# Altium schematic sheet MCU.SchDoc
size 259 x 167 mm; SheetNumber: 2; SheetTotal: 7
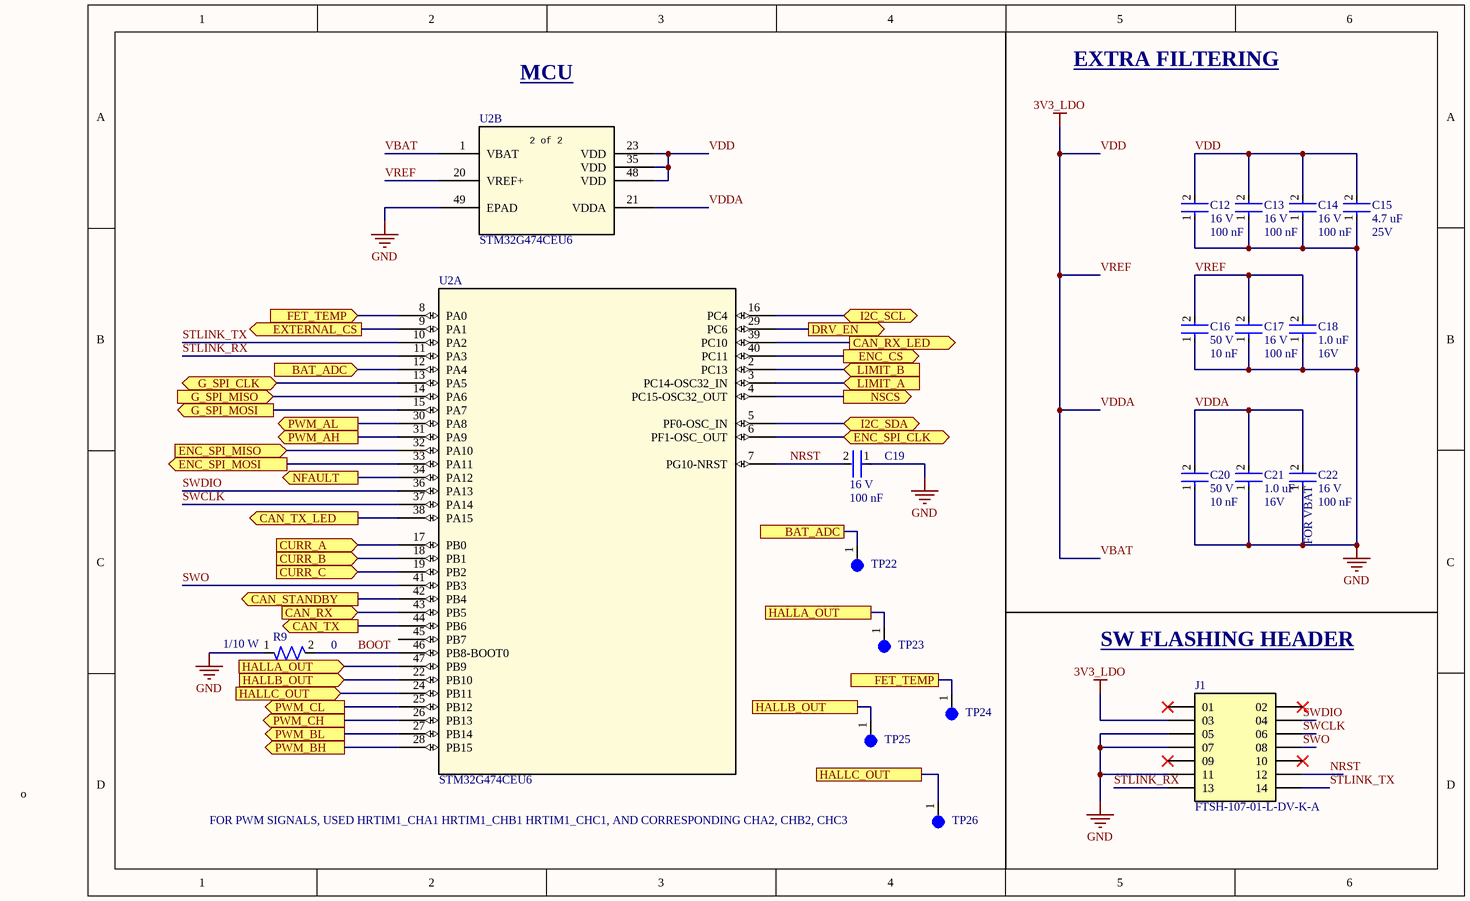
[diagram p0: MCU.SchDoc]

## Parts
C12  Voltage Rating: 16 V  Capacitance: 100 nF  [CAP-0402]  (hidden comment: CC0402KRX7R7BB104)
C13  Voltage Rating: 16 V  Capacitance: 100 nF  [CAP-0402]  (hidden comment: CC0402KRX7R7BB104)
C14  Voltage Rating: 16 V  Capacitance: 100 nF  [CAP-0402]  (hidden comment: CC0402KRX7R7BB104)
C15  Capacitance: 4.7 uF  Voltage: 25V  [CAP-0603]  (hidden comment: CC0603KRX5R8BB475)
C16  Voltage: 50 V  Capacitance: 10 nF  [CAP-0603]  (hidden comment: CC0603KPX7R9BB103)
C17  Voltage Rating: 16 V  Capacitance: 100 nF  [CAP-0402]  (hidden comment: CC0402KRX7R7BB104)
C18  Capacitance: 1.0 uF  Voltage: 16V  [CAP-0603]  (hidden comment: CC0603KRX7R7BB105)
C19  Voltage Rating: 16 V  Capacitance: 100 nF  [CAP-0402]  (hidden comment: CC0402KRX7R7BB104)
C20  Voltage: 50 V  Capacitance: 10 nF  [CAP-0603]  (hidden comment: CC0603KPX7R9BB103)
C21  Capacitance: 1.0 uF  Voltage: 16V  [CAP-0603]  (hidden comment: CC0603KRX7R7BB105)
C22  Voltage Rating: 16 V  Capacitance: 100 nF  [CAP-0402]  (hidden comment: CC0402KRX7R7BB104)
J1  FTSH-107-01-L-DV-K-A  [SAMTEC_FTSH-107-01-L-DV-K]
R9  Resistance: 0  Power: 1/10 W  [RES-0603]  (hidden comment: RMCF0603ZT0R00)
TP22  5003  [TEST-POINT-0001]  (value not drawn)
TP23  5003  [TEST-POINT-0001]  (value not drawn)
TP24  5003  [TEST-POINT-0001]  (value not drawn)
TP25  5003  [TEST-POINT-0001]  (value not drawn)
TP26  5003  [TEST-POINT-0001]  (value not drawn)
U2  STM32G474CEU6  [IC-QFPN48]  (parts A,B of 2)

## Ports
BAT_ADC (in, see Connectors[5A], MCU[3C]), BAT_ADC (see Connectors[5A], MCU[1B]), CAN_RX (in, see CAN[1B]), CAN_RX_LED (out, see CAN[6A]), CAN_STANDBY (out, see CAN[1B]), CAN_TX (out, see CAN[1B]), CAN_TX_LED (out, see CAN[4A]), CURR_A (in, see Driver[4C]), CURR_B (in, see Driver[4C]), CURR_C (in, see Driver[4C]), DRV_EN (out, see Driver[2B]), ENC_CS (out, see Encoder[2B]), ENC_SPI_CLK (bidir, see Connectors[1D], Encoder[2C]), ENC_SPI_MISO (in, see Connectors[2D], Encoder[2C]), ENC_SPI_MOSI (out, see Connectors[2D], Encoder[2C]), EXTERNAL_CS (out, see Connectors[1D]), FET_TEMP (in, see FETs[5B], MCU[4D]), FET_TEMP (see FETs[5B], MCU[1B]), G_SPI_CLK (bidir, see Driver[2C]), G_SPI_MISO (in, see Driver[1C]), G_SPI_MOSI (out, see Driver[2C]), HALLA_OUT (in, see Connectors[5C], MCU[3C]), HALLA_OUT (see Connectors[5C], MCU[1C]), HALLB_OUT (in, see Connectors[5C], MCU[3D]), HALLB_OUT (see Connectors[5C], MCU[1D]), HALLC_OUT (in, see Connectors[5D], MCU[4D]), HALLC_OUT (see Connectors[5D], MCU[1D]), I2C_SCL (bidir, see Connectors[2C]), I2C_SDA (bidir, see Connectors[1C]), LIMIT_A (in, see Connectors[2C]), LIMIT_B (in, see Connectors[3C]), NFAULT (out, see Driver[1D]), NSCS (out, see Driver[2C]), PWM_AH (out, see Driver[2C]), PWM_AL (out, see Driver[2C]), PWM_BH (out, see Driver[2C]), PWM_BL (out, see Driver[2C]), PWM_CH (out, see Driver[2C]), PWM_CL (out, see Driver[2C])

## Nets
GND: C12.1 C13.1 C14.1 C15.1 C16.1 C17.1 C18.1 C19.1 C20.1 C21.1 C22.1 J1.05 J1.07 J1.11 R9.1 U2.49(EPAD)
VBAT: C12.2 C13.2 C14.2 C15.2 C16.2 C17.2 C18.2 C20.2 C21.2 C22.2 J1.03 U2.1(VBAT) U2.20(VREF+) U2.21(VDDA) U2.23(VDD) U2.35(VDD) U2.48(VDD)  [also labelled 3V3_LDO, VDD, VDDA, VREF]
BAT_ADC: TP22.1 U2.12(PA4) ; port BAT_ADC
BOOT: R9.2 U2.46(PB8-BOOT0)
CAN_RX: U2.43(PB5) ; port CAN_RX
CAN_RX_LED: U2.39(PC10) ; port CAN_RX_LED
CAN_STANDBY: U2.42(PB4) ; port CAN_STANDBY
CAN_TX: U2.44(PB6) ; port CAN_TX
CAN_TX_LED: U2.38(PA15) ; port CAN_TX_LED
CURR_A: U2.17(PB0) ; port CURR_A
CURR_B: U2.18(PB1) ; port CURR_B
CURR_C: U2.19(PB2) ; port CURR_C
DRV_EN: U2.29(PC6) ; port DRV_EN
ENC_CS: U2.40(PC11) ; port ENC_CS
ENC_SPI_CLK: U2.6(PF1-OSC_OUT) ; port ENC_SPI_CLK
ENC_SPI_MISO: U2.32(PA10) ; port ENC_SPI_MISO
ENC_SPI_MOSI: U2.33(PA11) ; port ENC_SPI_MOSI
EXTERNAL_CS: U2.9(PA1) ; port EXTERNAL_CS
FET_TEMP: TP24.1 U2.8(PA0) ; port FET_TEMP
G_SPI_CLK: U2.13(PA5) ; port G_SPI_CLK
G_SPI_MISO: U2.14(PA6) ; port G_SPI_MISO
G_SPI_MOSI: U2.15(PA7) ; port G_SPI_MOSI
HALLA_OUT: TP23.1 U2.47(PB9) ; port HALLA_OUT
HALLB_OUT: TP25.1 U2.22(PB10) ; port HALLB_OUT
HALLC_OUT: TP26.1 U2.24(PB11) ; port HALLC_OUT
I2C_SCL: U2.16(PC4) ; port I2C_SCL
I2C_SDA: U2.5(PF0-OSC_IN) ; port I2C_SDA
LIMIT_A: U2.3(PC14-OSC32_IN) ; port LIMIT_A
LIMIT_B: U2.2(PC13) ; port LIMIT_B
NFAULT: U2.34(PA12) ; port NFAULT
NRST: C19.2 J1.12 U2.7(PG10-NRST)
NSCS: U2.4(PC15-OSC32_OUT) ; port NSCS
PWM_AH: U2.31(PA9) ; port PWM_AH
PWM_AL: U2.30(PA8) ; port PWM_AL
PWM_BH: U2.28(PB15) ; port PWM_BH
PWM_BL: U2.27(PB14) ; port PWM_BL
PWM_CH: U2.26(PB13) ; port PWM_CH
PWM_CL: U2.25(PB12) ; port PWM_CL
STLINK_RX: J1.13 U2.11(PA3)
STLINK_TX: J1.14 U2.10(PA2)
SWCLK: J1.06 U2.37(PA14)
SWDIO: J1.04 U2.36(PA13)
SWO: J1.08 U2.41(PB3)

Not connected (* = marked no-connect by the designer): J1 01* 02* 09* 10*; U2 45(PB7)

## Notes on the sheet
- MCU
- EXTRA FILTERING
- (near C22) FOR VBAT
- SW FLASHING HEADER
- o
- FOR PWM SIGNALS, USED HRTIM1_CHA1 HRTIM1_CHB1 HRTIM1_CHC1, AND CORRESPONDING CHA2, CHB2, CHC3
- (in symbol IC-STM32G474, part B) 2 of 2

## Library data of the parts
C12-C14 C17 C19 C22 = CAP-0.1U-0001: CAP CER 0.1UF 16V X7R 0402; ComponentLink2Description: Datasheet; ComponentLink2URL: https://www.yageo.com/upload/media/product/productsearch/datasheet/mlcc/UPY-GPHC_X7R_6.3V-to-250V_24.pdf; Device Class: Ceramic; Size: 0402
C15 = CAP-4.7U-0001: CAP CER 4.7UF 25V X5R 0603; Device Class: Ceramic; Size: 0603
C16 C20 = CAP-10N-0002: CAP CER 10000PF 50V X7R 0603; ComponentLink2Description: Datasheet; ComponentLink2URL: http://www.yageo.com/documents/recent/UPY-GPHC_X7R_6.3V-to-50V_18.pdf; Device Class: Ceramic; Size: 0603
C18 C21 = CAP-1U-0002: CAP CER 1UF 16V X7R 0603; Device Class: Ceramic; Size: 0603
J1 = CONN-Flashing: Connector Header Surface Mount 14 position 0.050 (1.27mm); MF: Samtec Inc.; SnapEDA_Link: https://www.snapeda.com/parts/FTSH-107-01-L-DV-K-A/Samtec+Inc./view-part/?ref=snap; Package: None; Value: *; MP: FTSH-107-01-L-DV-K-A; Check_prices: https://www.snapeda.com/parts/FTSH-107-01-L-DV-K-A/Samtec+Inc./view-part/?ref=eda; ComponentLink1Description: Datasheet; ComponentLink1URL: https://mm.digikey.com/Volume0/opasdata/d220001/medias/docus/6209/ftsh-1xx-xx-xxx-dv-xxx-xxx-x-xx-mkt.pdf?_gl=1*1c8qhrp*_up*MQ..*_gs*MQ..&gclid=Cj0KCQjwndHEBhDVARIsAGh0g3BhbAROHH0tQxim6dYiCi7CVIKM-WvKYR8T8zWoEwepZ3CPXWTcBI4aAtXsEALw_wcB&gclsrc=aw.ds&gbraid=0AAAAADrbLlju0DZp9CUD_BKsHNp-CszV5
R9 = RES-0-0001: 0 Ohms Jumper 0.1W, 1/10W Chip Resistor 0603 (1608 Metric) Automotive AEC-Q200 Thick Film; Package Size: 0603
TP22-TP26 = TEST-POINT-0001: Oranange PC Test Point, Miniature Phoisphor Bronze Silver Plating Through Hole Mounting Type
U2 = IC-STM32G474: ARM® Cortex®-M4F STM32G4 Microcontroller IC 32-Bit 170MHz 512KB (512K x 8) FLASH 48-UFQFPN (7x7); Manufacturer_Name: STMicroelectronics; Copyright: Copyright (C) 2025 Ultra Librarian. All rights reserved.; Manufacturer_Part_Number: STM32G474CEU6; RefDes: RefDes; Type: Type